# Altium schematic sheet 12V_LDO_3_3V.SchDoc
size A; SheetNumber: 4; SheetTotal: 5
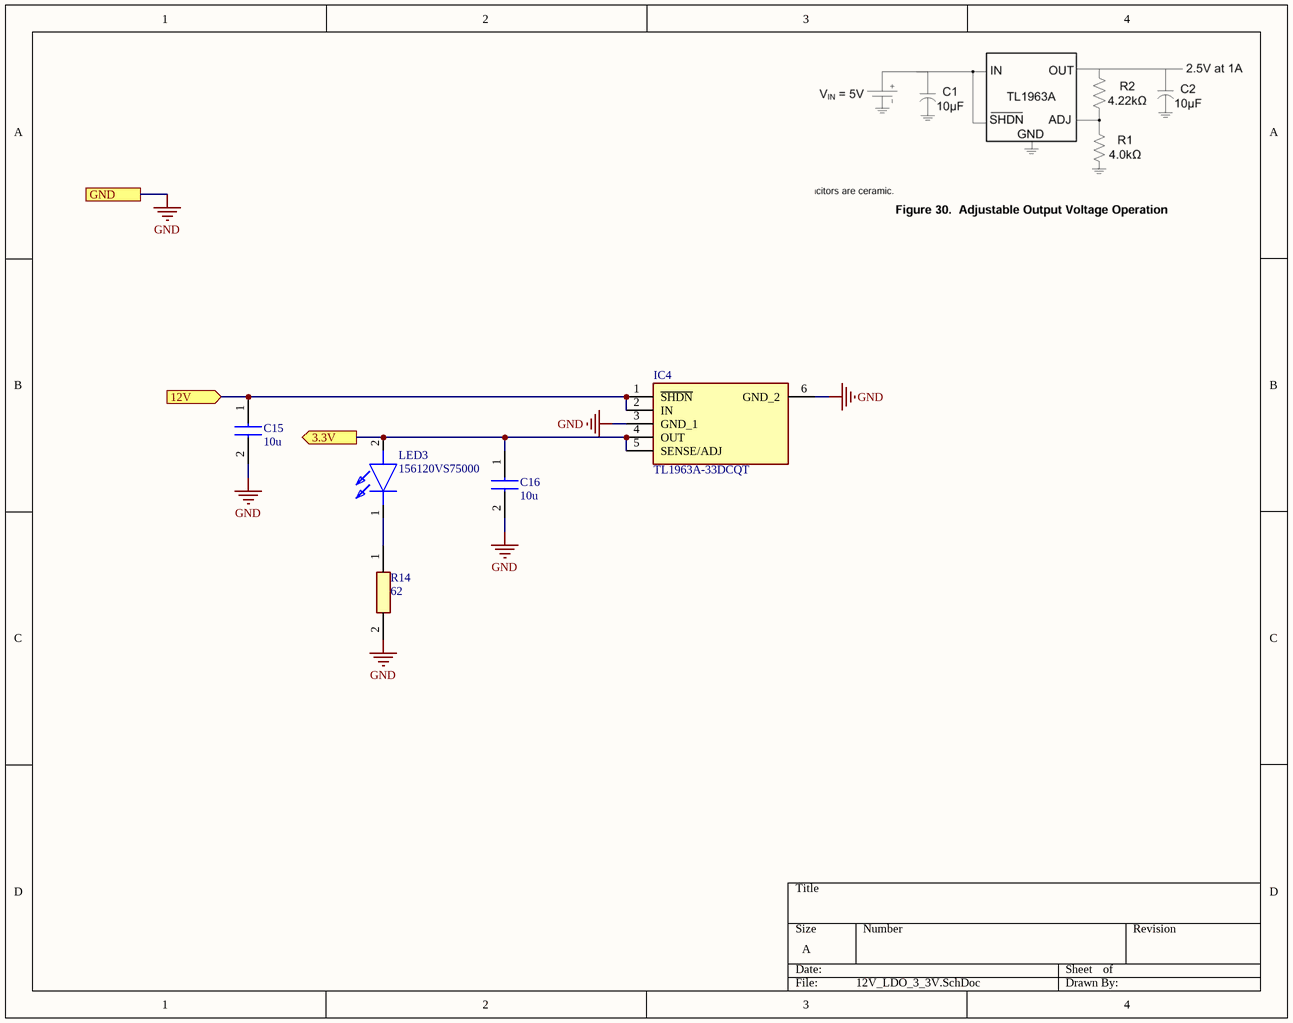
[diagram p0: 12V_LDO_3_3V.SchDoc]

## Parts
C15  10u  [CAPC3216X180N]
C16  10u  [CAPC3216X180N]
IC4  TL1963A-33DCQT  [SOT127P706X180-6N]
LED3  156120VS75000  [156120VS75000]
R14  62  [RESC3216X60N]

## Ports
3.3V (out), 12V (in), GND

## Nets
GND: C15.2 C16.2 IC4.3(GND_1) IC4.6(GND_2) R14.2 ; port GND
3.3V: C16.1 IC4.4(OUT) IC4.5(SENSE/ADJ) LED3.2(A) ; port 3.3V
12V: C15.1 IC4.1(~{SHDN}) IC4.2(IN) ; port 12V
NetLED3_1: LED3.1(K) R14.1

## Library data of the parts
C15 C16 = MLASU31LBB5106KTNA01: Capacitor; Manufacturer_Name: TAIYO YUDEN; Datasheet Link: https://mm.digikey.com/Volume0/opasdata/d220001/medias/docus/5731/MLR01_e.pdf; Height: 1.8mm; Manufacturer_Part_Number: MLASU31LBB5106KTNA01
IC4 = TL1963A-33DCQT: Integrated Circuit; Manufacturer_Name: Texas Instruments; Datasheet Link: http://www.ti.com/lit/gpn/TL1963A; Height: 1.8mm; Manufacturer_Part_Number: TL1963A-33DCQT; Mouser Part Number: 595-TL1963A-33DCQT; Mouser Price/Stock: https://www.mouser.co.uk/ProductDetail/Texas-Instruments/TL1963A-33DCQT?qs=g0HfZ8wh75AyKD2vs560PQ%3D%3D; Arrow Part Number: TL1963A-33DCQT; Arrow Price/Stock: https://www.arrow.com/en/products/tl1963a-33dcqt/texas-instruments?utm_currency=USD&region=nac
LED3 = 156120VS75000: LED; Manufacturer_Name: Wurth Elektronik; Datasheet Link: https://www.we-online.com/components/products/datasheet/156120VS75000.pdf; Height: 1.3mm; Manufacturer_Part_Number: 156120VS75000; Mouser Part Number: 710-156120VS75000; Mouser Price/Stock: https://www.mouser.co.uk/ProductDetail/Wurth-Elektronik/156120VS75000?qs=2kOmHSv6VfQAUFg5BeuEfQ%3D%3D
R14 = CRCW120662R0FKTA: Resistor; Manufacturer_Name: Vishay; Height: 0.6mm; Manufacturer_Part_Number: CRCW120662R0FKTA; Mouser Part Number: 71-CRCW1206-62; Mouser Price/Stock: https://www.mouser.co.uk/ProductDetail/Vishay-Dale/CRCW120662R0FKTA?qs=ZNjI1vpoWDOW7%2FSNU3Zcgg%3D%3D